# Altium project CatToy.PrjPcb
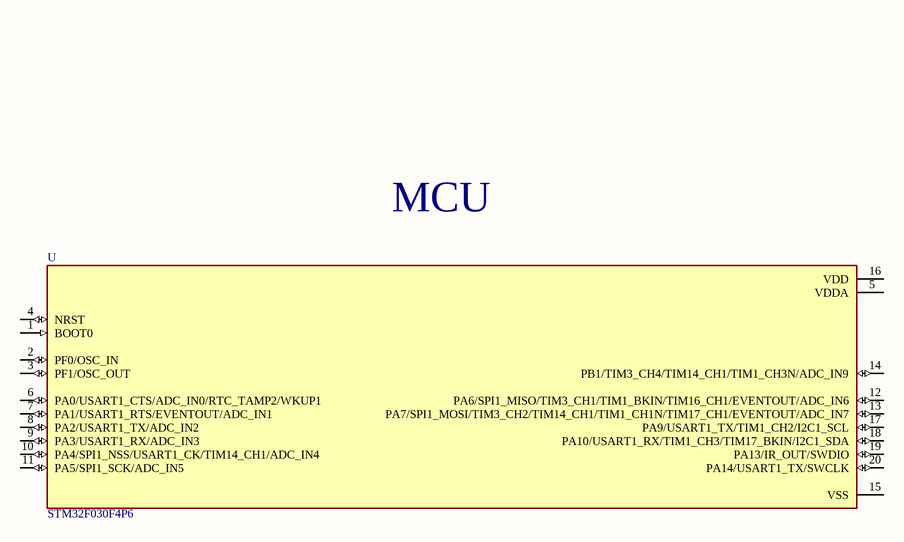
[diagram p0: MCU.SchDoc]
2 sheets, 10 parts. Net scope: flat (ports and power ports of the same name join across sheets).
Sheets:
  MCU.SchDoc
  Peripherals.SchDoc

## Sheet MCU.SchDoc
size A

### Parts
U  STM32F030F4P6  [SOP65P640X120-20N]

### Nets

Not connected (* = marked no-connect by the designer): U 1(BOOT0) 2(PF0/OSC_IN) 3(PF1/OSC_OUT) 4(NRST) 5(VDDA) 6(PA0/USART1_CTS/ADC_IN0/RTC_TAMP2/WKUP1) 7(PA1/USART1_RTS/EVENTOUT/ADC_IN1) 8(PA2/USART1_TX/ADC_IN2) 9(PA3/USART1_RX/ADC_IN3) 10(PA4/SPI1_NSS/USART1_CK/TIM14_CH1/ADC_IN4) 11(PA5/SPI1_SCK/ADC_IN5) 12(PA6/SPI1_MISO/TIM3_CH1/TIM1_BKIN/TIM16_CH1/EVENTOUT/ADC_IN6) 13(PA7/SPI1_MOSI/TIM3_CH2/TIM14_CH1/TIM1_CH1N/TIM17_CH1/EVENTOUT/ADC_IN7) 14(PB1/TIM3_CH4/TIM14_CH1/TIM1_CH3N/ADC_IN9) 15(VSS) 16(VDD) 17(PA9/USART1_TX/TIM1_CH2/I2C1_SCL) 18(PA10/USART1_RX/TIM1_CH3/TIM17_BKIN/I2C1_SDA) 19(PA13/IR_OUT/SWDIO) 20(PA14/USART1_TX/SWCLK)

### Notes on the sheet
- MCU

### Library data of the parts
U = STM32F030F4P6: ARMÂ® CortexÂ®-M0 STM32F0 Microcontroller IC 32-Bit 48MHz 16KB _16K x 8_ FLASH; MF: STMicroelectronics; MP: STM32F030F4P6; Package: TSSOP-20 STMicroelectronics; SnapEDA_Link: https://www.snapeda.com/parts/STM32F030F4P6/STMicroelectronics/view-part/46809/?ref=snap; Digi-Key_Purchase_URL: https://www.digikey.vn/product-detail/en/stmicroelectronics/STM32F030F4P6/497-14044-5-ND/4357517?utm_source=snapeda&utm_medium=aggregator&utm_campaign=symbol; Value: *; Digi-Key_Part_Number: 497-14044-5-ND

## Sheet Peripherals.SchDoc
size A
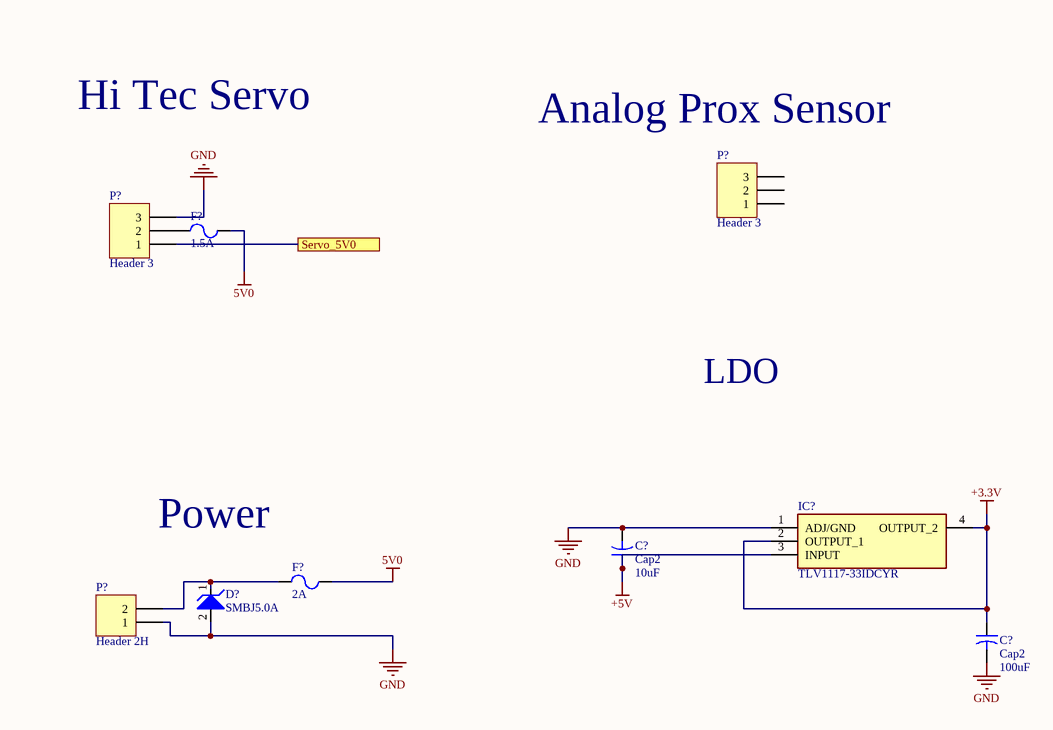
[diagram p1: Peripherals.SchDoc]

### Parts
(Parts that share a designator on the sheet are numbered #1, #2 ... from top to bottom, then left to right.)
C?#1  Cap2  value 10uF  [C0805]
C?#2  Cap2  value 100uF  [C0805]
D?  Manufacturer Part Number 1: SMBJ5.0A  [TVS_DIODE_BIDIRECTIONAL]  (hidden comment: TVS_DIODE_UNIDIR_5V)
F?#1  Current Rating: 1.5A  [FUSE_1206]  (hidden comment: FUSE_1.5A_1206)
F?#2  Current Rating: 2A  [FUSE_1206]  (hidden comment: FUSE_2A_1206)
IC?  TLV1117-33IDCYR  [SOT230P700X180-4N]
P?#1  Header 3  [HDR1X3]
P?#2  Header 3  [HDR1X3]
P?#3  Header 2H  [HDR1X2H]

### Ports
Servo_5V0

### Nets
5V0: F?#1.1 F?#2.2
+3.3V: C?#2.1 IC?.2(OUTPUT_1) IC?.4(OUTPUT_2)
+5V: C?#1.1 IC?.3(INPUT)
GND: C?#1.2 C?#2.2 D?.2 IC?.1(ADJ/GND) P?#2.3 P?#3.1
NetD?_1: D?.1 F?#2.1 P?#3.2
NetF?#1_2: F?#1.2 P?#2.2
NetP?#2_1: P?#2.1 ; port Servo_5V0

Not connected (* = marked no-connect by the designer): P?#1 1 2 3

### Notes on the sheet
- Hi Tec Servo
- (near P?#1) Analog Prox Sensor
- LDO
- Power

### Library data of the parts
C?#1 C?#2 = Cap2: Capacitor; Published: 23-Sep-2002; PackageReference: CAPR5-4X5; Publisher: Altium Limited; PackageDescription: Capacitor; 2 Leads
D? = TVS_DIODE_UNIDIR_5V: TVS DIODE 5V 9.2V DO214AA; Manufacturer 1: Littelfuse; Max Power Dissipation: 600W; Polarity: Unidirectional; Number of Elements: 1; Leakage Current: 800uA; Reverse Breakdown Voltage: 6.4V; Max Surge Current: 65.3A; Max Breakdown Voltage: 7V; Test Current: 10mA; Element Configuration: Single; Power Line Protection: No; Current: 68A; ESD Protection: Yes; Supplier 1: Digi-Key; Mount: Surface Mount; Case/Package: SMB; Number of Pins: 2; Min Operating Temperature: -55°C; Max Operating Temperature: 150°C; Power Dissipation: 600W; Direction: Unidirectional; Reverse Standoff Voltage: 5V; Min Breakdown Voltage: 6.4V; Clamping Voltage: 9.2V; Peak Pulse Power: 600W; Breakdown Voltage: 6.4V; Termination: SMD/SMT; Peak Pulse Current: 65.3A; Number of Channels: 1; Max Reverse Leakage Current: 800uA; Operating Supply Voltage: 5V; Number of Unidirectional Channels: 1; Composition: Zener; Voltage Rating (DC): 5V; Voltage: 5V; Length: 0.179inch; Height: 0.096inch; Width: 0.155inch; REACH SVHC: Unknown; ComponentLink7URL: https://datasheet.ciiva.com/331/littelfuse-tvs-diode-smbj-datasheet-pdf-331133.pdf?src-supplier=Digi-Key; ComponentLink7Description: https://datasheet.ciiva.com/331/littelfuse-tvs-diode-smbj-datasheet-pdf-331133.pdf?src-supplier=Digi-Key; Supplier Part Number 1: SMBJ5.0ALFCT-ND
F?#1 = FUSE_1.5A_1206: FUSE SMD 1.5A 63V; Manufacturer 1: Littelfuse; Manufacturer Part Number 1: 046601.5NR; Fuse Type: Board Mount (Cartridge Style Excluded); DC Cold Resistance: 31mR; Power Dissipation: 157.5mW; Approvals: UL,CSA; Supplier 1: Digi-Key; Mount: Surface Mount; Case/Package: 1206; Case Code (Imperial): 1206; Case Code (Metric): 3216; Housing Material: Ceramic; Min Operating Temperature: -55°C; Max Operating Temperature: 90°C; Voltage Rating (AC): 63V; Voltage Rating (DC): 63V; Current: 1.5A; Length: 3.18mm; Height: 0.023inch; Width: 0.06inch; Depth: 1.52mm; Supplier Part Number 1: F1462CT-ND
F?#2 = FUSE_2A_1206: FUSE SMD 2A 63V; Manufacturer 1: Littelfuse; Manufacturer Part Number 1: 0466002.NRHF; Fuse Type: Board Mount (Cartridge Style Excluded); DC Cold Resistance: 31mR; Power Dissipation: 157.5mW; Approvals: UL,CSA; Supplier 1: Digi-Key; Mount: Surface Mount; Case/Package: 1206; Case Code (Imperial): 1206; Case Code (Metric): 3216; Housing Material: Ceramic; Min Operating Temperature: -55°C; Max Operating Temperature: 90°C; Voltage Rating (AC): 63V; Voltage Rating (DC): 63V; Current: 2A; Length: 3.18mm; Height: 0.023inch; Width: 0.06inch; Depth: 1.52mm; Supplier Part Number 1: F5696CT-ND
IC? = TLV1117-33CDCYR: Integrated Circuit; Manufacturer_Name: Texas Instruments; Datasheet Link: http://www.ti.com/lit/gpn/tlv1117; Height: 1.8mm; Manufacturer_Part_Number: TLV1117-33CDCYR; Arrow Part Number: TLV1117-33CDCYR; Arrow Price/Stock: https://www.arrow.com/en/products/tlv1117-33cdcyr/texas-instruments; Mouser Part Number: 595-TLV1117-33CDCYR; Mouser Price/Stock: https://www.mouser.co.uk/ProductDetail/Texas-Instruments/TLV1117-33CDCYR?qs=p6lVfQR1GSoiRKz8KGIbKg%3D%3D
P?#1 P?#2 = Header 3: Header, 3-Pin; LatestRevisionDate: 17-Jul-2002; LatestRevisionNote: Re-released for DXP Platform.; Publisher: Altium Limited
P?#3 = Header 2H: Header, 2-Pin, Right Angle; LatestRevisionDate: 17-Jul-2002; LatestRevisionNote: Re-released for DXP Platform.; Publisher: Altium Limited